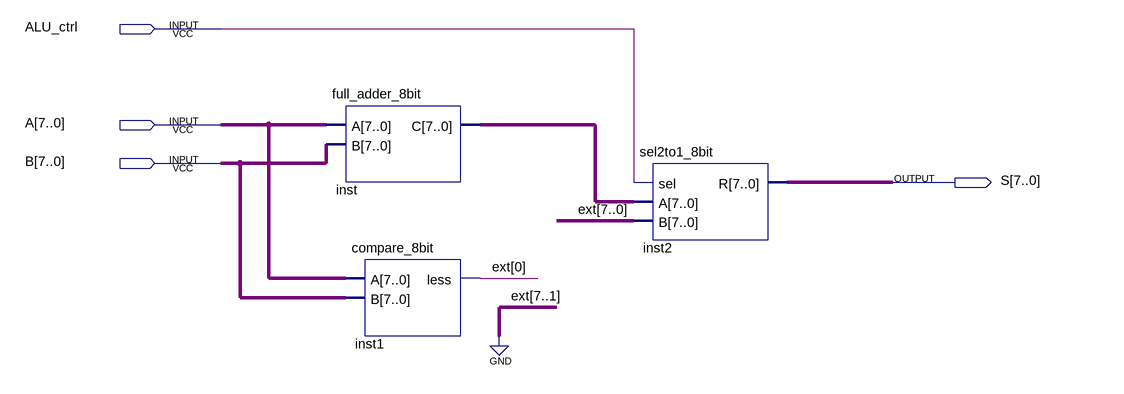
[diagram p0: schematic sheet]
// Quartus schematic ALU.bdf as structural Verilog: 3 symbols, 4 pins
module ALU (
  input  ALU_ctrl,
  input  [7:0] A,
  input  [7:0] B,
  output [7:0] S
);

  wire [0:0] ext;
  wire [7:0] inst_c;

  full_adder_8bit inst (.A(A), .B(B), .C(inst_c));
  compare_8bit inst1 (.A(A), .B(B), .less(ext[0]));
  sel2to1_8bit inst2 (.sel(ALU_ctrl), .A(inst_c), .B({{7{1'b0}}, ext[0]}), .R(S));
endmodule
